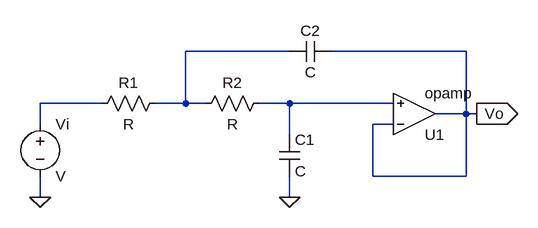
[diagram p0: schematic Draft_con_sallen_key.asc]
Draft_con_sallen_key.asc, the LTspice schematic file:
Version 4
SHEET 1 880 680
WIRE 0 64 -160 64
WIRE 272 64 64 64
WIRE -288 144 -384 144
WIRE -160 144 -160 64
WIRE -160 144 -208 144
WIRE -128 144 -160 144
WIRE 0 144 -48 144
WIRE 160 144 0 144
WIRE 272 160 272 64
WIRE 272 160 224 160
WIRE 288 160 272 160
WIRE -384 176 -384 144
WIRE 160 176 128 176
WIRE 0 192 0 144
WIRE 128 256 128 176
WIRE 272 256 272 160
WIRE 272 256 128 256
WIRE -384 288 -384 256
WIRE 0 288 0 256
FLAG 288 160 Vo
IOPIN 288 160 Out
FLAG 0 288 0
FLAG -384 288 0
SYMBOL OpAmps\\opamp 192 224 M180
SYMATTR InstName U1
SYMBOL res -304 160 R270
WINDOW 0 32 56 VTop 2
WINDOW 3 0 56 VBottom 2
SYMATTR InstName R1
SYMBOL res -144 160 R270
WINDOW 0 32 56 VTop 2
WINDOW 3 0 56 VBottom 2
SYMATTR InstName R2
SYMBOL cap -16 192 R0
SYMATTR InstName C1
SYMBOL cap 64 48 R90
WINDOW 0 0 32 VBottom 2
WINDOW 3 32 32 VTop 2
SYMATTR InstName C2
SYMBOL voltage -384 160 R0
SYMATTR InstName Vi

The netlist it stands for:
* Draft_con_sallen_key.asc
XU1 Vo N003 Vo opamp Aol=100K GBW=10Meg  ; pins invin noninvin out
R1 N002 N001 R
R2 N001 N003 R
C1 N003 0 C
C2 Vo N001 C
Vi N002 0 V
.backanno
.end